# Altium schematic sheet MiniMax 4bit.schdoc
size 497 x 353 mm
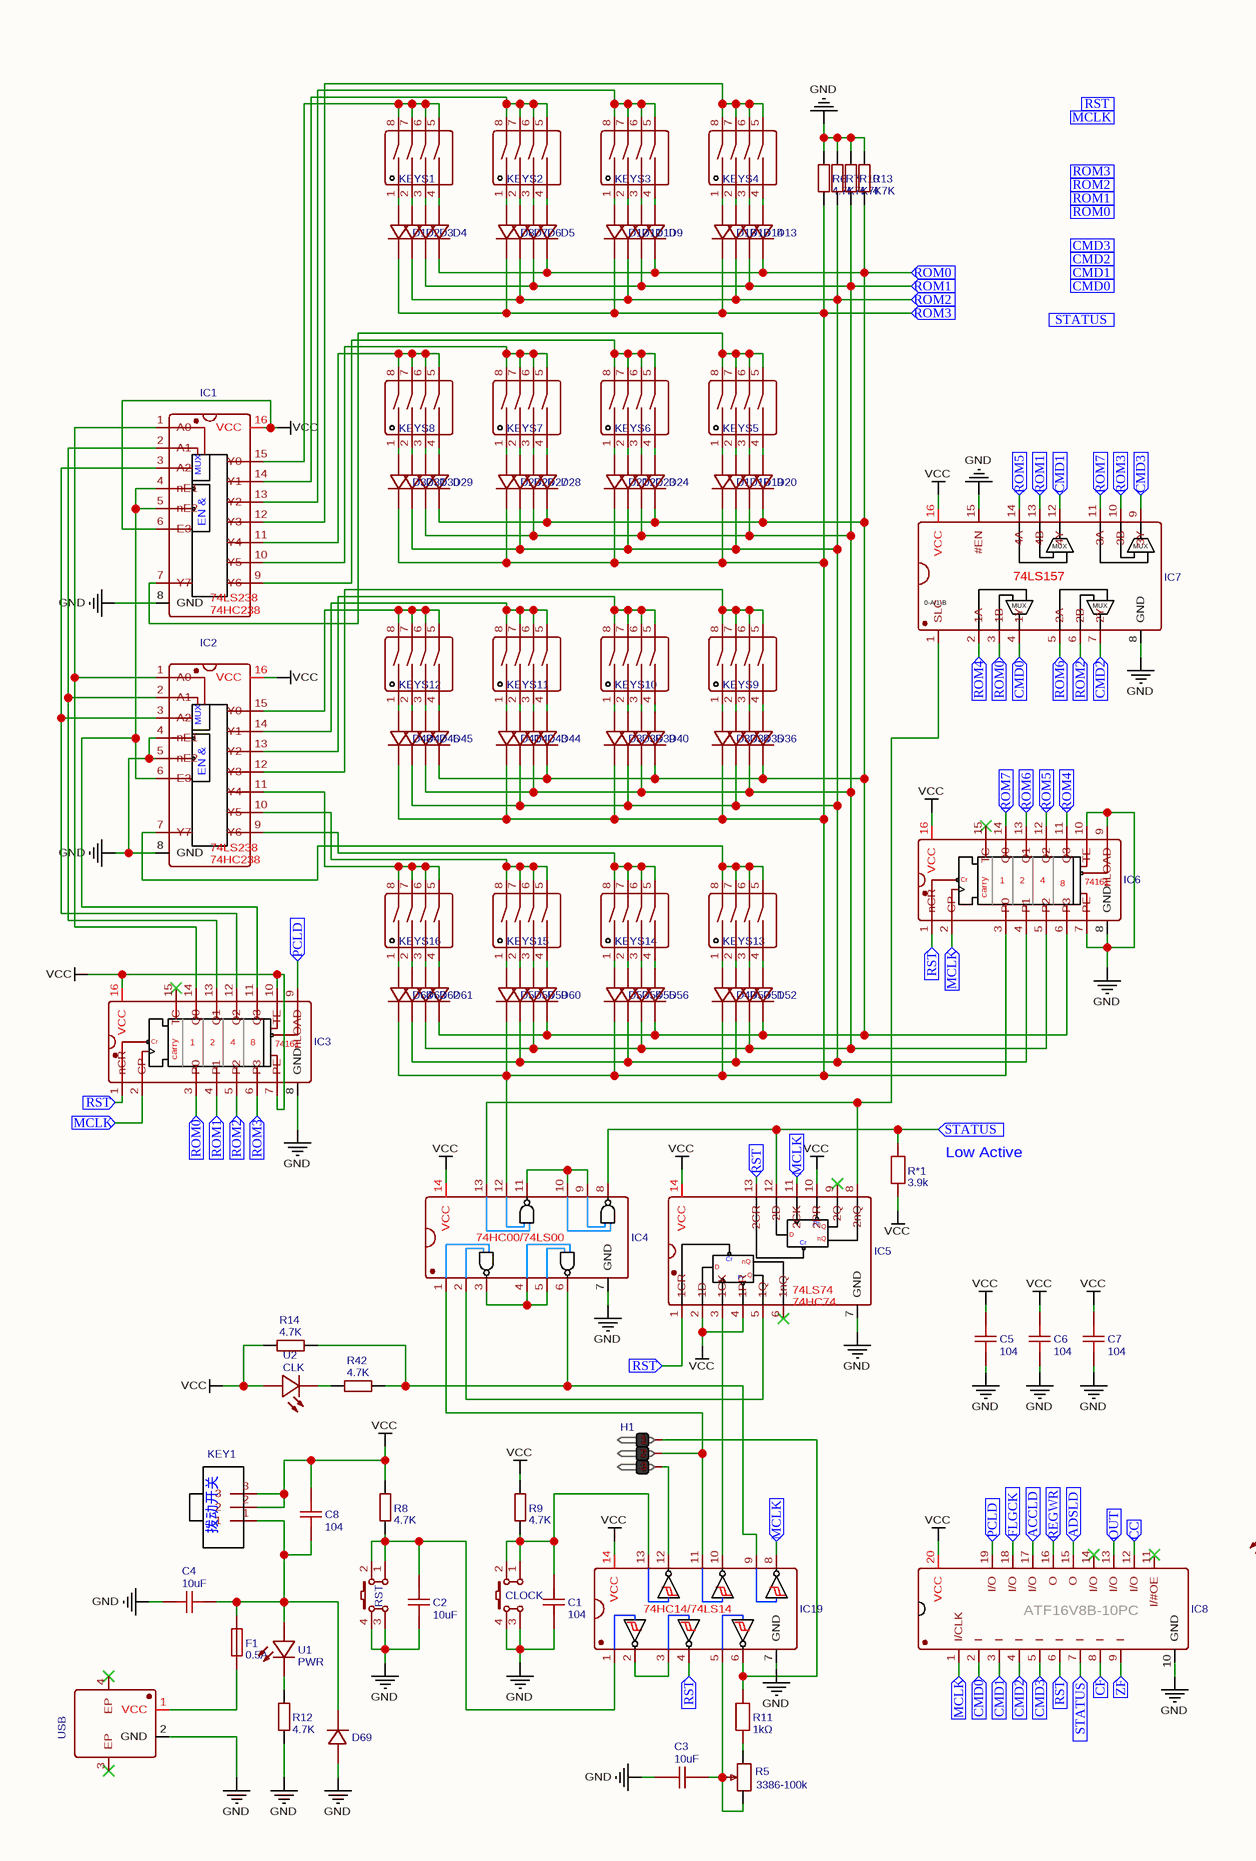
[diagram p0: MiniMax 4bit.schdoc, left]
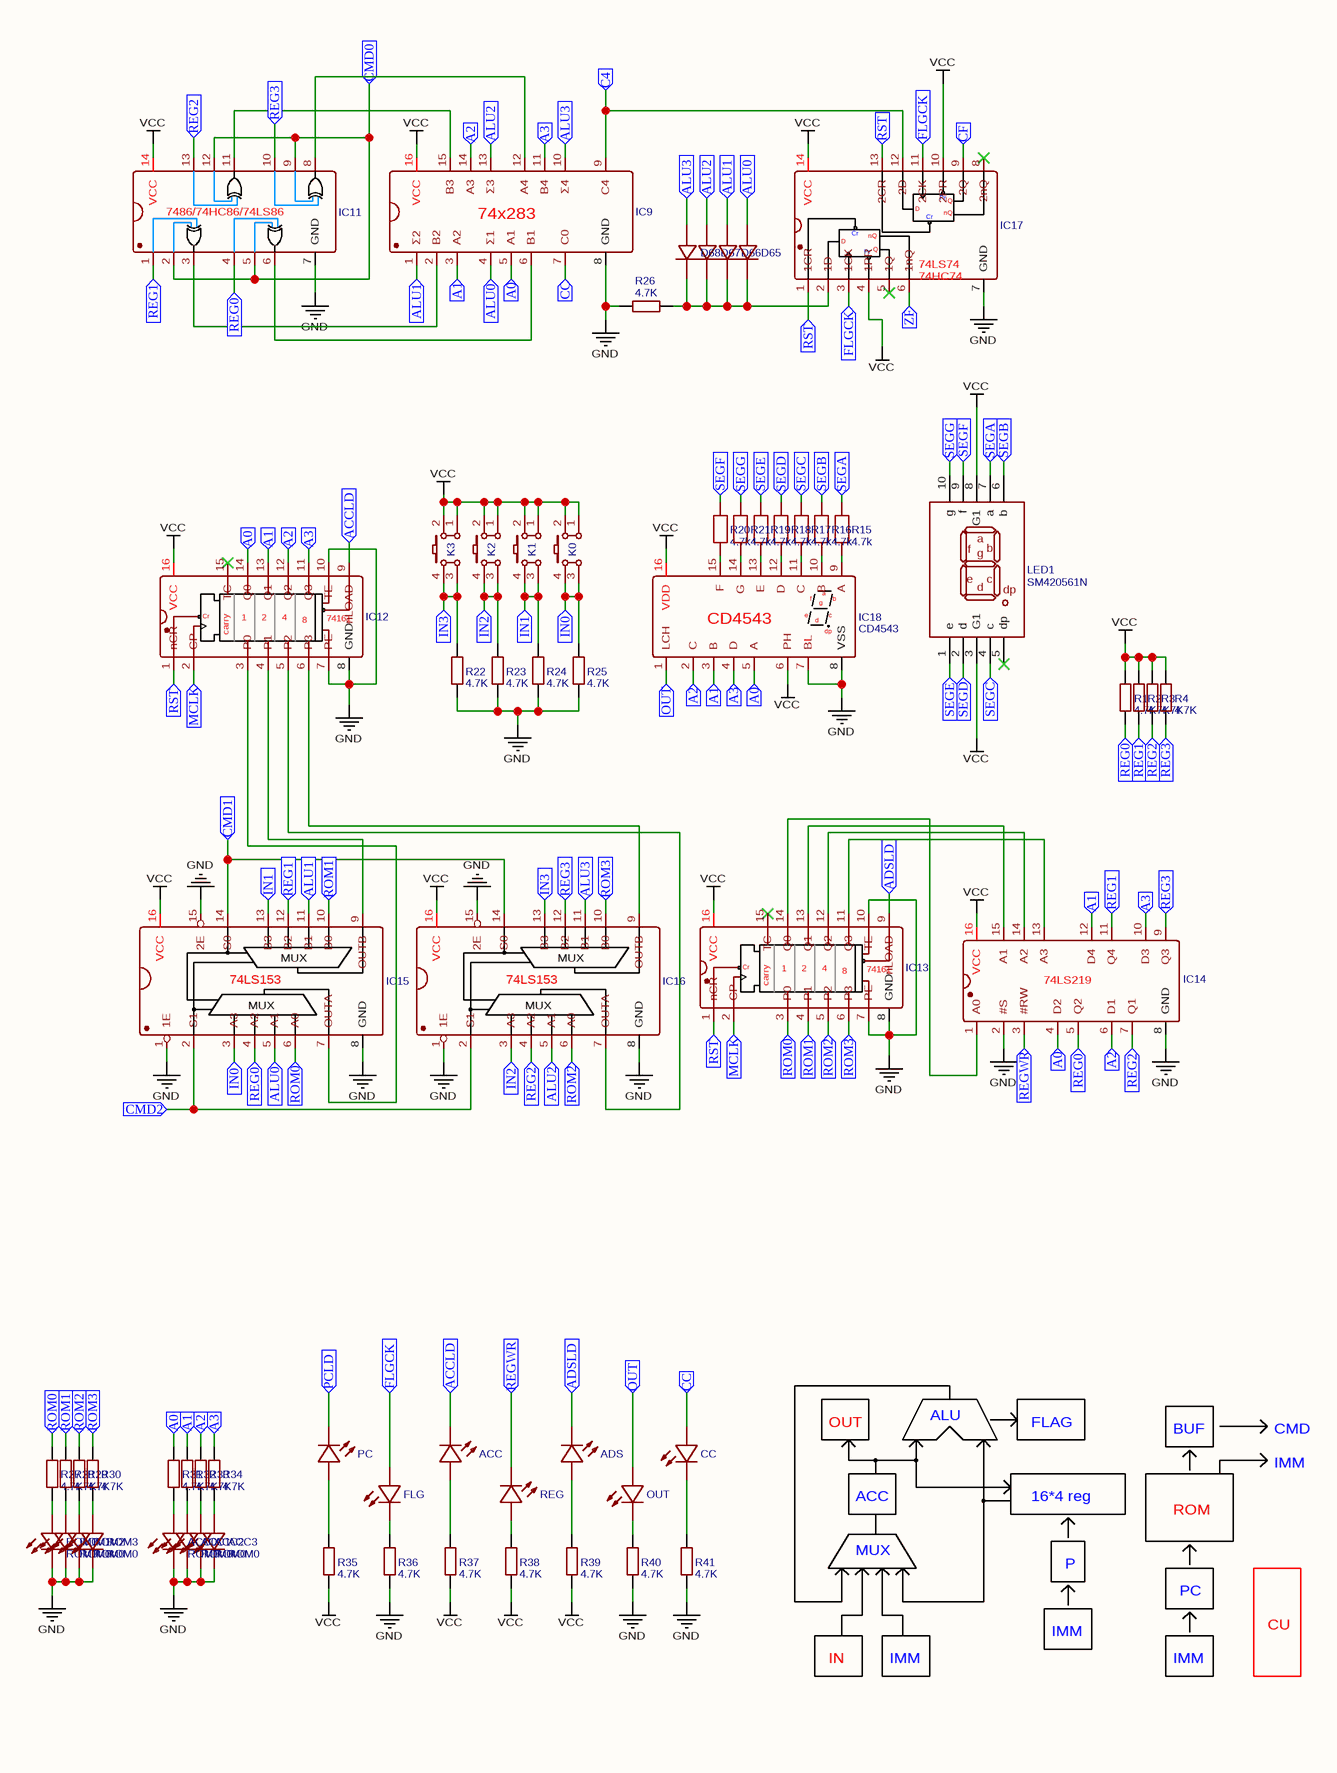
[diagram p1: MiniMax 4bit.schdoc, right]

## Parts
ACC  ROM0  [LED0805-RD]  (value not drawn)
ACC0  ROM0  [LED0805-RD]
ACC1  ROM0  [LED0805-RD]
ACC2  ROM0  [LED0805-RD]
ACC3  ROM0  [LED0805-RD]
ADS  ROM0  [LED0805-RD]  (value not drawn)
C1  104  [C0805]
C2  10uF  [C1206]
C3  10uF  [C1206]
C4  10uF  [C1206]
C5  104  [C0805]
C6  104  [C0805]
C7  104  [C0805]
C8  104  [C0805]
CC  ROM0  [LED0805-RD]  (value not drawn)
CLOCK  K4-6×6_TH  [KEY-TH_4P-L6.0-W6.0-P4.50-LS6.5]  (value not drawn)
D1  LL4148SG  [LL-34_L3.5-W1.5-LS3.5-FD]  (value not drawn)
D2  LL4148SG  [LL-34_L3.5-W1.5-LS3.5-FD]  (value not drawn)
D3  LL4148SG  [LL-34_L3.5-W1.5-LS3.5-FD]  (value not drawn)
D4  LL4148SG  [LL-34_L3.5-W1.5-LS3.5-FD]  (value not drawn)
D5  LL4148SG  [LL-34_L3.5-W1.5-LS3.5-FD]  (value not drawn)
D6  LL4148SG  [LL-34_L3.5-W1.5-LS3.5-FD]  (value not drawn)
D7  LL4148SG  [LL-34_L3.5-W1.5-LS3.5-FD]  (value not drawn)
D8  LL4148SG  [LL-34_L3.5-W1.5-LS3.5-FD]  (value not drawn)
D9  LL4148SG  [LL-34_L3.5-W1.5-LS3.5-FD]  (value not drawn)
D10  LL4148SG  [LL-34_L3.5-W1.5-LS3.5-FD]  (value not drawn)
D11  LL4148SG  [LL-34_L3.5-W1.5-LS3.5-FD]  (value not drawn)
D12  LL4148SG  [LL-34_L3.5-W1.5-LS3.5-FD]  (value not drawn)
D13  LL4148SG  [LL-34_L3.5-W1.5-LS3.5-FD]  (value not drawn)
D14  LL4148SG  [LL-34_L3.5-W1.5-LS3.5-FD]  (value not drawn)
D15  LL4148SG  [LL-34_L3.5-W1.5-LS3.5-FD]  (value not drawn)
D16  LL4148SG  [LL-34_L3.5-W1.5-LS3.5-FD]  (value not drawn)
D17  LL4148SG  [LL-34_L3.5-W1.5-LS3.5-FD]  (value not drawn)
D18  LL4148SG  [LL-34_L3.5-W1.5-LS3.5-FD]  (value not drawn)
D19  LL4148SG  [LL-34_L3.5-W1.5-LS3.5-FD]  (value not drawn)
D20  LL4148SG  [LL-34_L3.5-W1.5-LS3.5-FD]  (value not drawn)
D21  LL4148SG  [LL-34_L3.5-W1.5-LS3.5-FD]  (value not drawn)
D22  LL4148SG  [LL-34_L3.5-W1.5-LS3.5-FD]  (value not drawn)
D23  LL4148SG  [LL-34_L3.5-W1.5-LS3.5-FD]  (value not drawn)
D24  LL4148SG  [LL-34_L3.5-W1.5-LS3.5-FD]  (value not drawn)
D25  LL4148SG  [LL-34_L3.5-W1.5-LS3.5-FD]  (value not drawn)
D26  LL4148SG  [LL-34_L3.5-W1.5-LS3.5-FD]  (value not drawn)
D27  LL4148SG  [LL-34_L3.5-W1.5-LS3.5-FD]  (value not drawn)
D28  LL4148SG  [LL-34_L3.5-W1.5-LS3.5-FD]  (value not drawn)
D29  LL4148SG  [LL-34_L3.5-W1.5-LS3.5-FD]  (value not drawn)
D30  LL4148SG  [LL-34_L3.5-W1.5-LS3.5-FD]  (value not drawn)
D31  LL4148SG  [LL-34_L3.5-W1.5-LS3.5-FD]  (value not drawn)
D32  LL4148SG  [LL-34_L3.5-W1.5-LS3.5-FD]  (value not drawn)
D33  LL4148SG  [LL-34_L3.5-W1.5-LS3.5-FD]  (value not drawn)
D34  LL4148SG  [LL-34_L3.5-W1.5-LS3.5-FD]  (value not drawn)
D35  LL4148SG  [LL-34_L3.5-W1.5-LS3.5-FD]  (value not drawn)
D36  LL4148SG  [LL-34_L3.5-W1.5-LS3.5-FD]  (value not drawn)
D37  LL4148SG  [LL-34_L3.5-W1.5-LS3.5-FD]  (value not drawn)
D38  LL4148SG  [LL-34_L3.5-W1.5-LS3.5-FD]  (value not drawn)
D39  LL4148SG  [LL-34_L3.5-W1.5-LS3.5-FD]  (value not drawn)
D40  LL4148SG  [LL-34_L3.5-W1.5-LS3.5-FD]  (value not drawn)
D41  LL4148SG  [LL-34_L3.5-W1.5-LS3.5-FD]  (value not drawn)
D42  LL4148SG  [LL-34_L3.5-W1.5-LS3.5-FD]  (value not drawn)
D43  LL4148SG  [LL-34_L3.5-W1.5-LS3.5-FD]  (value not drawn)
D44  LL4148SG  [LL-34_L3.5-W1.5-LS3.5-FD]  (value not drawn)
D45  LL4148SG  [LL-34_L3.5-W1.5-LS3.5-FD]  (value not drawn)
D46  LL4148SG  [LL-34_L3.5-W1.5-LS3.5-FD]  (value not drawn)
D47  LL4148SG  [LL-34_L3.5-W1.5-LS3.5-FD]  (value not drawn)
D48  LL4148SG  [LL-34_L3.5-W1.5-LS3.5-FD]  (value not drawn)
D49  LL4148SG  [LL-34_L3.5-W1.5-LS3.5-FD]  (value not drawn)
D50  LL4148SG  [LL-34_L3.5-W1.5-LS3.5-FD]  (value not drawn)
D51  LL4148SG  [LL-34_L3.5-W1.5-LS3.5-FD]  (value not drawn)
D52  LL4148SG  [LL-34_L3.5-W1.5-LS3.5-FD]  (value not drawn)
D53  LL4148SG  [LL-34_L3.5-W1.5-LS3.5-FD]  (value not drawn)
D54  LL4148SG  [LL-34_L3.5-W1.5-LS3.5-FD]  (value not drawn)
D55  LL4148SG  [LL-34_L3.5-W1.5-LS3.5-FD]  (value not drawn)
D56  LL4148SG  [LL-34_L3.5-W1.5-LS3.5-FD]  (value not drawn)
D57  LL4148SG  [LL-34_L3.5-W1.5-LS3.5-FD]  (value not drawn)
D58  LL4148SG  [LL-34_L3.5-W1.5-LS3.5-FD]  (value not drawn)
D59  LL4148SG  [LL-34_L3.5-W1.5-LS3.5-FD]  (value not drawn)
D60  LL4148SG  [LL-34_L3.5-W1.5-LS3.5-FD]  (value not drawn)
D61  LL4148SG  [LL-34_L3.5-W1.5-LS3.5-FD]  (value not drawn)
D62  LL4148SG  [LL-34_L3.5-W1.5-LS3.5-FD]  (value not drawn)
D63  LL4148SG  [LL-34_L3.5-W1.5-LS3.5-FD]  (value not drawn)
D64  LL4148SG  [LL-34_L3.5-W1.5-LS3.5-FD]  (value not drawn)
D65  LL4148SG  [LL-34_L3.5-W1.5-LS3.5-FD]  (value not drawn)
D66  LL4148SG  [LL-34_L3.5-W1.5-LS3.5-FD]  (value not drawn)
D67  LL4148SG  [LL-34_L3.5-W1.5-LS3.5-FD]  (value not drawn)
D68  LL4148SG  [LL-34_L3.5-W1.5-LS3.5-FD]  (value not drawn)
D69  LL4148SG  [LL-34_L3.5-W1.5-LS3.5-FD]  (value not drawn)
F1  0.5A  [F1206]
FLG  ROM0  [LED0805-RD]  (value not drawn)
H1  排针V2_2.54_1X3  [HDR-TH_3P-P2.54-V-M-1]  (value not drawn)
IC1  74238/74LS238/74HC238  [PDIP-16]  (value not drawn)
IC2  74238/74LS238/74HC238  [PDIP-16]  (value not drawn)
IC3  74161/74LS161/74HC161  [PDIP-16]  (value not drawn)
IC4  7400/74LS00/74HC00  [DIP-14N]  (value not drawn)
IC5  7474/74LS74/74HC74  [DIP-14N]  (value not drawn)
IC6  74161/74LS161/74HC161  [PDIP-16]  (value not drawn)
IC7  74157/74LS157/74HC157  [PDIP-16]  (value not drawn)
IC8  ATF16V8B  [PDIP-20]  (value not drawn)
IC9  74283/74LS283/74HC283  [PDIP-16]  (value not drawn)
IC11  7486/74LS86/74HC86  [DIP-14N]  (value not drawn)
IC12  74161/74LS161/74HC161  [PDIP-16]  (value not drawn)
IC13  74161/74LS161/74HC161  [PDIP-16]  (value not drawn)
IC14  74LS219  [PDIP-16]  (value not drawn)
IC15  74153/74LS153/74HC153  [PDIP-16]  (value not drawn)
IC16  74153/74LS153/74HC153  [PDIP-16]  (value not drawn)
IC17  7474/74LS74/74HC74  [DIP-14N]  (value not drawn)
IC18  CD4543  [PDIP-16]
IC19  7414/74LS14/74HC14  [DIP-14N]  (value not drawn)
K0  K4-6×6_TH  [KEY-TH_4P-L6.0-W6.0-P4.50-LS6.5]  (value not drawn)
K1  K4-6×6_TH  [KEY-TH_4P-L6.0-W6.0-P4.50-LS6.5]  (value not drawn)
K2  K4-6×6_TH  [KEY-TH_4P-L6.0-W6.0-P4.50-LS6.5]  (value not drawn)
K3  K4-6×6_TH  [KEY-TH_4P-L6.0-W6.0-P4.50-LS6.5]  (value not drawn)
KEY1  拨动开关2.54*3直插  [拨动开关-2.54*3]  (value not drawn)
KEYS1  2.54 插件4位拨码开关  [2.54 插件4位拨码开关]  (value not drawn)
KEYS2  2.54 插件4位拨码开关  [2.54 插件4位拨码开关]  (value not drawn)
KEYS3  2.54 插件4位拨码开关  [2.54 插件4位拨码开关]  (value not drawn)
KEYS4  2.54 插件4位拨码开关  [2.54 插件4位拨码开关]  (value not drawn)
KEYS5  2.54 插件4位拨码开关  [2.54 插件4位拨码开关]  (value not drawn)
KEYS6  2.54 插件4位拨码开关  [2.54 插件4位拨码开关]  (value not drawn)
KEYS7  2.54 插件4位拨码开关  [2.54 插件4位拨码开关]  (value not drawn)
KEYS8  2.54 插件4位拨码开关  [2.54 插件4位拨码开关]  (value not drawn)
KEYS9  2.54 插件4位拨码开关  [2.54 插件4位拨码开关]  (value not drawn)
KEYS10  2.54 插件4位拨码开关  [2.54 插件4位拨码开关]  (value not drawn)
KEYS11  2.54 插件4位拨码开关  [2.54 插件4位拨码开关]  (value not drawn)
KEYS12  2.54 插件4位拨码开关  [2.54 插件4位拨码开关]  (value not drawn)
KEYS13  2.54 插件4位拨码开关  [2.54 插件4位拨码开关]  (value not drawn)
KEYS14  2.54 插件4位拨码开关  [2.54 插件4位拨码开关]  (value not drawn)
KEYS15  2.54 插件4位拨码开关  [2.54 插件4位拨码开关]  (value not drawn)
KEYS16  2.54 插件4位拨码开关  [2.54 插件4位拨码开关]  (value not drawn)
LED1  SM420561N  [LED-SEG-TH_10P-L12.7-W19.0-P2.54-S15.24-BL]
OUT  ROM0  [LED0805-RD]  (value not drawn)
PC  ROM0  [LED0805-RD]  (value not drawn)
R1  4.7K  [R0805]
R2  4.7K  [R0805]
R3  4.7K  [R0805]
R4  4.7K  [R0805]
R5  3386-100k  [RES-ADJ-TH_3386P]
R6  4.7K  [R0805]
R7  4.7K  [R0805]
R8  4.7K  [R0805]
R9  4.7K  [R0805]
R10  4.7K  [R0805]
R11  1kΩ  [R0805]
R12  4.7K  [R0805]
R13  4.7K  [R0805]
R14  4.7K  [R0805]
R15  4.7k  [R0805]
R16  4.7k  [R0805]
R17  4.7k  [R0805]
R18  4.7k  [R0805]
R19  4.7k  [R0805]
R20  4.7k  [R0805]
R21  4.7k  [R0805]
R22  4.7K  [R0805]
R23  4.7K  [R0805]
R24  4.7K  [R0805]
R25  4.7K  [R0805]
R26  4.7K  [R0805]
R27  4.7K  [R0805]
R28  4.7K  [R0805]
R29  4.7K  [R0805]
R30  4.7K  [R0805]
R31  4.7K  [R0805]
R32  4.7K  [R0805]
R33  4.7K  [R0805]
R34  4.7K  [R0805]
R35  4.7K  [R0805]
R36  4.7K  [R0805]
R37  4.7K  [R0805]
R38  4.7K  [R0805]
R39  4.7K  [R0805]
R40  4.7K  [R0805]
R41  4.7K  [R0805]
R42  4.7K  [R0805]
R*1  3.9k  [R0805]
REG  ROM0  [LED0805-RD]  (value not drawn)
ROM0  ROM0  [LED0805-RD]
ROM1  ROM0  [LED0805-RD]
ROM2  ROM0  [LED0805-RD]
ROM3  ROM0  [LED0805-RD]
RST  K4-6×6_TH  [KEY-TH_4P-L6.0-W6.0-P4.50-LS6.5]  (value not drawn)
U1  PWR  [LED0805-RD]
U2  CLK  [LED0805-RD]
USB  KH-TYPE-C-2P  [USB-SMD_KH-TYPE-C-2P]  (value not drawn)

## Ports
A0 (in), A1 (in), A2 (in), A3 (in), ACCLD (in), ADSLD (in), ALU0 (in), ALU1 (in), ALU2 (in), ALU3 (in), C4 (in), CC (in), CF (in), CMD0 (in), CMD1 (in), CMD2 (in), CMD3 (in), FLGCK (in), IN0 (in), IN1 (in), IN2 (in), IN3 (in), MCLK (in), OUT (in), PCLD (in), REG0 (in), REG1 (in), REG2 (in), REG3 (in), REGWR (in), ROM0 (in), ROM1 (in), ROM2 (in), ROM3 (in), ROM4 (in), ROM5 (in), ROM6 (in), ROM7 (in), RST (in), SEGA (in), SEGB (in), SEGC (in), SEGD (in), SEGE (in), SEGF (in), SEGG (in), STATUS (in), ZF (in)

## Nets
GND: ACC0.1(-) ACC1.1(-) ACC2.1(-) ACC3.1(-) C1.2 C2.1 C3.1 C4.2 C5.2 C6.2 C7.2 CLOCK.3 CLOCK.4 D69.1(A) IC1.8(GND) IC2.4(nE1) IC2.5(nE2) IC2.8(GND) IC3.8(GND) IC4.7(GND) IC5.7(GND) IC6.7(PE) IC6.8(GND) IC6.9(nLOAD) IC6.10(TE) IC7.8(GND) IC7.15(#EN) IC8.10(GND) IC9.8(GND) IC11.7(GND) IC12.7(PE) IC12.8(GND) IC12.10(TE) IC13.7(PE) IC13.8(GND) IC13.10(TE) IC14.2(#S) IC14.8(GND) IC15.1(1E) IC15.8(GND) IC15.15(2E) IC16.1(1E) IC16.8(GND) IC16.15(2E) IC17.7(GND) IC18.7(BL) IC18.8(VSS) IC19.7(GND) R6.2 R7.2 R10.2 R12.1 R13.2 R22.1 R23.1 R24.1 R25.1 R26.2 R36.1 R40.1 R41.1 ROM0.1(-) ROM1.1(-) ROM2.1(-) ROM3.1(-) RST.3 RST.4 USB.2(GND)
VCC: C5.1 C6.1 C7.1 C8.1 IC1.6(E3) IC1.16(VCC) IC2.16(VCC) IC3.7(PE) IC3.10(TE) IC3.16(VCC) IC4.14(VCC) IC5.2(1D) IC5.4(1PR) IC5.10(2PR) IC5.14(VCC) IC6.16(VCC) IC7.16(VCC) IC8.20(VCC) IC9.16(VCC) IC11.14(VCC) IC12.16(VCC) IC13.16(VCC) IC14.16(VCC) IC15.16(VCC) IC16.16(VCC) IC17.4(1PR) IC17.10(2PR) IC17.14(VCC) IC18.6(PH) IC18.16(VDD) IC19.14(VCC) K0.1 K0.2 K1.1 K1.2 K2.1 K2.2 K3.1 K3.2 KEY1.2 KEY1.3 LED1.3(G1) LED1.8(G1) R1.2 R2.2 R3.2 R4.2 R8.2 R9.2 R14.2 R35.1 R37.1 R38.1 R39.1 R*1.2 U2.2(+)
A0: IC9.5(A1) IC12.14(Q0) IC14.4(D2) IC18.5(A) R31.2 ; port A0
A1: IC9.3(A2) IC12.13(Q1) IC14.12(D4) IC18.3(B) R32.2 ; port A1
A2: IC9.14(A3) IC12.12(Q2) IC14.6(D1) IC18.2(C) R33.2 ; port A2
A3: IC9.11(B4) IC12.11(Q3) IC14.10(D3) IC18.4(D) R34.2 ; port A3
ACCLD: ACC.1(-) IC8.17(I/O) IC12.9(nLOAD) ; port ACCLD
ADSLD: ADS.1(-) IC8.15(O) IC13.9(nLOAD) IC13.11(Q3) IC14.13(A3) ; port ADSLD
ALU0: D65.1(A) IC9.4(Σ1) IC15.5(A1) ; port ALU0
ALU1: D66.1(A) IC9.1(Σ2) IC15.11(B1) ; port ALU1
ALU2: D67.1(A) IC9.13(Σ3) IC16.5(A1) ; port ALU2
ALU3: D68.1(A) IC9.10(Σ4) IC16.11(B1) ; port ALU3
C4: IC9.9(C4) IC17.12(2D) ; port C4
CC: CC.2(+) IC8.12(I/O) IC9.7(C0) ; port CC
CF: IC8.8(I) IC17.9(2Q) ; port CF
CMD0: IC7.4(1Y) IC8.2(I) IC11.2(1B) IC11.5(2B) IC11.9(3A) IC11.12(4A) ; port CMD0
CMD1: IC7.12(4Y) IC8.3(I) IC15.14(S0) IC16.14(S0) ; port CMD1
CMD2: IC7.7(2Y) IC8.4(I) IC15.2(S1) IC16.2(S1) ; port CMD2
CMD3: IC7.9(3Y) IC8.5(I) ; port CMD3
FLGCK: FLG.2(+) IC8.18(I/O) IC17.3(1CK) IC17.11(2CK) ; port FLGCK
IN0: IC15.3(A3) K0.3 K0.4 R25.2 ; port IN0
IN1: IC15.13(B3) K1.3 K1.4 R24.2 ; port IN1
IN2: IC16.3(A3) K2.3 K2.4 R23.2 ; port IN2
IN3: IC16.13(B3) K3.3 K3.4 R22.2 ; port IN3
MCLK: IC3.2(CP) IC5.11(2CK) IC6.2(CP) IC8.1(I/CLK) IC12.2(CP) IC13.2(CP) IC19.8(6Y) ; port MCLK
OUT: IC8.13(I/O) IC18.1(LCH) OUT.2(+) ; port OUT
PCLD: IC3.9(nLOAD) IC8.19(I/O) PC.1(-) ; port PCLD
REG0: IC11.4(2A) IC14.5(Q2) IC15.4(A2) R1.1 ; port REG0
REG1: IC11.1(1A) IC14.11(Q4) IC15.12(B2) R2.1 ; port REG1
REG2: IC11.13(4B) IC14.7(Q1) IC16.4(A2) R3.1 ; port REG2
REG3: IC11.10(3B) IC14.9(Q3) IC16.12(B2) R4.1 ; port REG3
REGWR: IC8.16(O) IC14.3(#RW) REG.1(-) ; port REGWR
ROM0: D4.2(C) D5.2(C) D9.2(C) D13.2(C) D20.2(C) D24.2(C) D28.2(C) D29.2(C) D36.2(C) D40.2(C) D44.2(C) D45.2(C) D52.2(C) D56.2(C) D60.2(C) D61.2(C) IC3.3(P0) IC6.6(P3) IC7.3(1B) IC13.3(P0) IC15.6(A0) R13.1 R27.2 ; port ROM0
ROM1: D3.2(C) D6.2(C) D10.2(C) D14.2(C) D19.2(C) D23.2(C) D27.2(C) D30.2(C) D35.2(C) D39.2(C) D43.2(C) D46.2(C) D51.2(C) D55.2(C) D59.2(C) D62.2(C) IC3.4(P1) IC6.5(P2) IC7.13(4B) IC13.4(P1) IC15.10(B0) R10.1 R28.2 ; port ROM1
ROM2: D2.2(C) D7.2(C) D11.2(C) D15.2(C) D18.2(C) D22.2(C) D26.2(C) D31.2(C) D34.2(C) D38.2(C) D42.2(C) D47.2(C) D50.2(C) D54.2(C) D58.2(C) D63.2(C) IC3.5(P2) IC6.4(P1) IC7.6(2B) IC13.5(P2) IC16.6(A0) R7.1 R29.2 ; port ROM2
ROM3: D1.2(C) D8.2(C) D12.2(C) D16.2(C) D17.2(C) D21.2(C) D25.2(C) D32.2(C) D33.2(C) D37.2(C) D41.2(C) D48.2(C) D49.2(C) D53.2(C) D57.2(C) D64.2(C) IC3.6(P3) IC4.12(4A) IC6.3(P0) IC7.10(3B) IC13.6(P3) IC16.10(B0) R6.1 R30.2 ; port ROM3
ROM4: IC6.11(Q3) IC7.2(1A) ; port ROM4
ROM5: IC6.12(Q2) IC7.14(4A) ; port ROM5
ROM6: IC6.13(Q1) IC7.5(2A) ; port ROM6
ROM7: IC6.14(Q0) IC7.11(3A) ; port ROM7
RST: IC3.1(nCR) IC5.1(1CR) IC5.13(2CR) IC6.1(nCR) IC8.6(I) IC12.1(nCR) IC13.1(nCR) IC17.1(1CR) IC17.13(2CR) IC19.4(2Y) ; port RST
SEGA: LED1.7(a) R15.2 ; port SEGA
SEGB: LED1.6(b) R16.2 ; port SEGB
SEGC: LED1.4(c) R17.2 ; port SEGC
SEGD: LED1.2(d) R18.2 ; port SEGD
SEGE: LED1.1(e) R19.2 ; port SEGE
SEGF: LED1.9(f) R20.2 ; port SEGF
SEGG: LED1.10(g) R21.2 ; port SEGG
STATUS: IC4.8(3Y) IC5.12(2D) IC8.7(I) R*1.1 ; port STATUS
ZF: IC8.9(I) IC17.6(1nQ) ; port ZF
NetACC0_2: ACC0.2(+) R31.1
NetACC1_2: ACC1.2(+) R32.1
NetACC2_2: ACC2.2(+) R33.1
NetACC3_2: ACC3.2(+) R34.1
NetACC_2: ACC.2(+) R37.2
NetADS_2: ADS.2(+) R39.2
NetC1_1: C1.1 CLOCK.1 CLOCK.2 IC19.13(4A) R9.1
NetC2_2: C2.2 IC19.1(1A) R8.1 RST.1 RST.2
NetC3_2: C3.2 IC19.5(3A) R5.2 R5.3
NetC4_1: C4.1 C8.2 D69.2(C) F1.2 KEY1.1 U1.2(+)
NetCC_1: CC.1(-) R41.2
NetD1_1: D1.1(A) KEYS1.1
NetD2_1: D2.1(A) KEYS1.2
NetD3_1: D3.1(A) KEYS1.3
NetD4_1: D4.1(A) KEYS1.4
NetD5_1: D5.1(A) KEYS2.4
NetD6_1: D6.1(A) KEYS2.3
NetD7_1: D7.1(A) KEYS2.2
NetD8_1: D8.1(A) KEYS2.1
NetD9_1: D9.1(A) KEYS3.4
NetD10_1: D10.1(A) KEYS3.3
NetD11_1: D11.1(A) KEYS3.2
NetD12_1: D12.1(A) KEYS3.1
NetD13_1: D13.1(A) KEYS4.4
NetD14_1: D14.1(A) KEYS4.3
NetD15_1: D15.1(A) KEYS4.2
NetD16_1: D16.1(A) KEYS4.1
NetD17_1: D17.1(A) KEYS5.1
NetD18_1: D18.1(A) KEYS5.2
NetD19_1: D19.1(A) KEYS5.3
NetD20_1: D20.1(A) KEYS5.4
NetD21_1: D21.1(A) KEYS6.1
NetD22_1: D22.1(A) KEYS6.2
NetD23_1: D23.1(A) KEYS6.3
NetD24_1: D24.1(A) KEYS6.4
NetD25_1: D25.1(A) KEYS7.1
NetD26_1: D26.1(A) KEYS7.2
NetD27_1: D27.1(A) KEYS7.3
NetD28_1: D28.1(A) KEYS7.4
NetD29_1: D29.1(A) KEYS8.4
NetD30_1: D30.1(A) KEYS8.3
NetD31_1: D31.1(A) KEYS8.2
NetD32_1: D32.1(A) KEYS8.1
NetD33_1: D33.1(A) KEYS9.1
NetD34_1: D34.1(A) KEYS9.2
NetD35_1: D35.1(A) KEYS9.3
NetD36_1: D36.1(A) KEYS9.4
NetD37_1: D37.1(A) KEYS10.1
NetD38_1: D38.1(A) KEYS10.2
NetD39_1: D39.1(A) KEYS10.3
NetD40_1: D40.1(A) KEYS10.4
NetD41_1: D41.1(A) KEYS11.1
NetD42_1: D42.1(A) KEYS11.2
NetD43_1: D43.1(A) KEYS11.3
NetD44_1: D44.1(A) KEYS11.4
NetD45_1: D45.1(A) KEYS12.4
NetD46_1: D46.1(A) KEYS12.3
NetD47_1: D47.1(A) KEYS12.2
NetD48_1: D48.1(A) KEYS12.1
NetD49_1: D49.1(A) KEYS13.1
NetD50_1: D50.1(A) KEYS13.2
NetD51_1: D51.1(A) KEYS13.3
NetD52_1: D52.1(A) KEYS13.4
NetD53_1: D53.1(A) KEYS14.1
NetD54_1: D54.1(A) KEYS14.2
NetD55_1: D55.1(A) KEYS14.3
NetD56_1: D56.1(A) KEYS14.4
NetD57_1: D57.1(A) KEYS15.1
NetD58_1: D58.1(A) KEYS15.2
NetD59_1: D59.1(A) KEYS15.3
NetD60_1: D60.1(A) KEYS15.4
NetD61_1: D61.1(A) KEYS16.4
NetD62_1: D62.1(A) KEYS16.3
NetD63_1: D63.1(A) KEYS16.2
NetD64_1: D64.1(A) KEYS16.1
NetD65_2: D65.2(C) D66.2(C) D67.2(C) D68.2(C) IC17.2(1D) R26.1
NetF1_1: F1.1 USB.1(VCC)
NetFLG_1: FLG.1(-) R36.2
NetH1_1: H1.1 IC19.6(3Y) R11.2
NetH1_2: H1.2 IC4.1(1A) IC19.11(5A)
NetH1_3: H1.3 IC19.12(4Y)
NetIC1_1: IC1.1(A0) IC2.1(A0) IC3.14(Q0)
NetIC1_2: IC1.2(A1) IC2.2(A1) IC3.13(Q1)
NetIC1_3: IC1.3(A2) IC2.3(A2) IC3.12(Q2)
NetIC1_4: IC1.4(nE1) IC1.5(nE2) IC2.6(E3) IC3.11(Q3)
NetIC1_7: IC1.7(Y7) KEYS5.5 KEYS5.6 KEYS5.7 KEYS5.8
NetIC1_9: IC1.9(Y6) KEYS6.5 KEYS6.6 KEYS6.7 KEYS6.8
NetIC1_10: IC1.10(Y5) KEYS7.5 KEYS7.6 KEYS7.7 KEYS7.8
NetIC1_11: IC1.11(Y4) KEYS8.5 KEYS8.6 KEYS8.7 KEYS8.8
NetIC1_12: IC1.12(Y3) KEYS4.5 KEYS4.6 KEYS4.7 KEYS4.8
NetIC1_13: IC1.13(Y2) KEYS3.5 KEYS3.6 KEYS3.7 KEYS3.8
NetIC1_14: IC1.14(Y1) KEYS2.5 KEYS2.6 KEYS2.7 KEYS2.8
NetIC1_15: IC1.15(Y0) KEYS1.5 KEYS1.6 KEYS1.7 KEYS1.8
NetIC2_7: IC2.7(Y7) KEYS13.5 KEYS13.6 KEYS13.7 KEYS13.8
NetIC2_9: IC2.9(Y6) KEYS14.5 KEYS14.6 KEYS14.7 KEYS14.8
NetIC2_10: IC2.10(Y5) KEYS15.5 KEYS15.6 KEYS15.7 KEYS15.8
NetIC2_11: IC2.11(Y4) KEYS16.5 KEYS16.6 KEYS16.7 KEYS16.8
NetIC2_12: IC2.12(Y3) KEYS9.5 KEYS9.6 KEYS9.7 KEYS9.8
NetIC2_13: IC2.13(Y2) KEYS10.5 KEYS10.6 KEYS10.7 KEYS10.8
NetIC2_14: IC2.14(Y1) KEYS11.5 KEYS11.6 KEYS11.7 KEYS11.8
NetIC2_15: IC2.15(Y0) KEYS12.5 KEYS12.6 KEYS12.7 KEYS12.8
NetIC4_2: IC4.2(1B) IC5.5(1Q)
NetIC4_3: IC4.3(1Y) IC4.4(2A) IC4.5(2B)
NetIC4_6: IC4.6(2Y) IC19.9(6A) R14.1 R42.1
NetIC4_9: IC4.9(3A) IC4.10(3B) IC4.11(4Y)
NetIC4_13: IC4.13(4B) IC5.8(2nQ) IC7.1(SLC)
NetIC5_3: IC5.3(1CK) IC19.10(5Y)
NetIC9_2: IC9.2(B2) IC11.3(1Y)
NetIC9_6: IC9.6(B1) IC11.6(2Y)
NetIC9_12: IC9.12(A4) IC11.8(3Y)
NetIC9_15: IC9.15(B3) IC11.11(4Y)
NetIC12_3: IC12.3(P0) IC15.7(OUTA)
NetIC12_4: IC12.4(P1) IC15.9(OUTB)
NetIC12_5: IC12.5(P2) IC16.7(OUTA)
NetIC12_6: IC12.6(P3) IC16.9(OUTB)
NetIC13_12: IC13.12(Q2) IC14.14(A2)
NetIC13_13: IC13.13(Q1) IC14.15(A1)
NetIC13_14: IC13.14(Q0) IC14.1(A0)
NetIC18_9: IC18.9(A) R15.1
NetIC18_10: IC18.10(B) R16.1
NetIC18_11: IC18.11(C) R17.1
NetIC18_12: IC18.12(D) R18.1
NetIC18_13: IC18.13(E) R19.1
NetIC18_14: IC18.14(G) R21.1
NetIC18_15: IC18.15(F) R20.1
NetIC19_2: IC19.2(1Y) IC19.3(2A)
NetOUT_1: OUT.1(-) R40.2
NetPC_2: PC.2(+) R35.2
NetR5_1: R5.1 R11.1
NetR12_2: R12.2 U1.1(-)
NetR27_1: R27.1 ROM0.2(+)
NetR28_1: R28.1 ROM1.2(+)
NetR29_1: R29.1 ROM2.2(+)
NetR30_1: R30.1 ROM3.2(+)
NetR38_2: R38.2 REG.2(+)
NetR42_2: R42.2 U2.1(-)

Not connected (* = marked no-connect by the designer): IC3 15(TC)*; IC5 6(1nQ)* 9(2Q)*; IC6 15(TC)*; IC8 11(I/#OE)* 14(I/O)*; IC12 15(TC)*; IC13 15(TC)*; IC17 5(1Q)* 8(2nQ)*; LED1 5(dp)*; USB 3(EP)* 4(EP)*

## Notes on the sheet
- (near R*1) Low Active
- ALU
- OUT
- FLAG
- BUF
- CMD
- IMM
- ACC
- MUX
- 16*4 reg
- ROM
- P
- PC
- IN
- CU
- (in symbol 7400/74LS00/74HC00) 74HC00/74LS00
- (in symbol 7414/74LS14/74HC14) 74HC14/74LS14
- (in symbol 7474/74LS74/74HC74) Pr; Q; D; Cr; nQ; 74LS74 / 74HC74
- (in symbol 7486/74LS86/74HC86) 7486/74HC86/74LS86
- (in symbol 74153/74LS153/74HC153) MUX; 74LS153
- (in symbol 74157/74LS157/74HC157) MUX; 74LS157; 0-A/1-B
- (in symbol 74161/74LS161/74HC161) Cr; 74161; carry
- (in symbol 74238/74LS238/74HC238) MUX; EN &; 74LS238 / 74HC238
- (in symbol 74283/74LS283/74HC283) 74x283
- (in symbol ATF16V8B) ATF16V8B-10PC
- (in symbol CD4543) a; f; b; g; e; c; d; dp
- (in symbol 拨动开关2.54*3直插) 拨动开关

## Library data of the parts
ACC ACC0-ACC3 ADS CC FLG OUT PC REG ROM0-ROM3 = ROM0: Manufacturer: null; Manufacturer Part: LED0805-1; Contributor: LCSC; Supplier: LCSC; Supplier Part: C9900006888; JLCPCB Part Class: Extended Part; spicePre: U; spiceSymbolName: LED0805-1
C1 C5-C8 = 104: Manufacturer: YAGEO(国巨); Manufacturer Part: CC0805JRX7R7BB104; Capacitance: 100nF; Contributor: lcsc; Supplier: LCSC; Supplier Part: C520082; spicePre: C; spiceSymbolName: CC0805JRX7R7BB104
C2-C4 = 10uF: Manufacturer: KEMET(基美); Manufacturer Part: C1206C225J5RECAUTO; nameAlias: Capacitance; Contributor: lcsc; Supplier: LCSC; Supplier Part: C1513220; JLCPCB Part Class: Extended Part; spicePre: C; spiceSymbolName: C1206C225J5RECAUTO
CLOCK K0-K3 RST = K4-6×6_TH: Manufacturer: 韩国韩荣; Manufacturer Part: K2-1102DP-E4SW-04; Contributor: LCEDA_Lib; Supplier: LCSC; Supplier Part: C136684; spicePre: K; spiceSymbolName: K4-6×6_TH
D1-D69 = LL4148SG: Manufacturer: null; Contributor: lcsc; Supplier: LCSC; Supplier Part: C9900015421; Manufacturer Part: LL4148SG; JLCPCB Part Class: Extended Part; spicePre: U; spiceSymbolName: LL4148SG
F1 = 0.5A: Manufacturer: Littelfuse(美国力特); Manufacturer Part: 1206L016WR; Contributor: LCSC; Supplier: LCSC; Supplier Part: C151161; JLCPCB Part Class: Extended Part; spicePre: F; spiceSymbolName: 1206L016WR
H1 = 排针V2_2.54_1X3: Manufacturer: BOOMELE; Manufacturer Part: Header2.54mm 1*3P; Contributor: WOSHI6666444444; Supplier: LCSC; Supplier Part: C49257; JLCPCB Part Class: Extended Part; spicePre: H; spiceSymbolName: 排针V2_2.54_1X3
IC1 IC2 = 74238/74LS238/74HC238: Manufacturer: FM富满; Manufacturer Part: 74HC138T; Contributor: king13478509115; Supplier: LCSC; Supplier Part: C2906781; spicePre: I; spiceSymbolName: 74238/74LS238/74HC238
IC3 IC6 IC12 IC13 = 74161/74LS161/74HC161: Manufacturer: TI(德州仪器); Manufacturer Part: CD74HC161E; Contributor: king13478509115; Supplier: LCSC; Supplier Part: C1523311; spicePre: I; spiceSymbolName: 74161/74LS161/74HC161
IC4 = 7400/74LS00/74HC00: Manufacturer: TI; Manufacturer Part: SN74HC00N; Contributor: king13478509115; spicePre: X; Supplier: LCSC; Supplier Part: C2902; JLCPCB Part Class: Extended Part; spiceSymbolName: 7400/74LS00/74HC00
IC5 IC17 = 7474/74LS74/74HC74: Manufacturer: RENESAS(瑞萨)/IDT; Manufacturer Part: HD74HC74P; Contributor: king13478509115; Supplier: LCSC; Supplier Part: C5275; JLCPCB Part Class: Extended Part; spicePre: I; spiceSymbolName: 7474/74LS74/74HC74
IC7 = 74157/74LS157/74HC157: Manufacturer: Texas Instruments; Manufacturer Part: SN74LS148N; Contributor: king13478509115; Supplier: LCSC; Supplier Part: C81840; JLCPCB Part Class: Extended Part; spicePre: I; spiceSymbolName: 74157/74LS157/74HC157
IC8 = ATF16V8B: Manufacturer: ATMEL; Contributor: king13478509115; spicePre: X; spiceSymbolName: ATF16V8B
IC9 = 74283/74LS283/74HC283: Contributor: king13478509115; spicePre: I; spiceSymbolName: 74283/74LS283/74HC283
IC11 = 7486/74LS86/74HC86: Manufacturer: TI; Manufacturer Part: SN74HC00N; Contributor: king13478509115; spicePre: X; Supplier: LCSC; Supplier Part: C2902; JLCPCB Part Class: Extended Part; spiceSymbolName: 7486/74LS86/74HC86
IC14 = 74LS219: Manufacturer: TI(德州仪器); Contributor: king13478509115; Supplier: LCSC; spicePre: I; spiceSymbolName: 74LS219
IC15 IC16 = 74153/74LS153/74HC153: Manufacturer: Texas Instruments; Manufacturer Part: SN74LS148N; Contributor: king13478509115; Supplier: LCSC; Supplier Part: C81840; JLCPCB Part Class: Extended Part; spicePre: I; spiceSymbolName: 74153/74LS153/74HC153
IC18 = CD4543: Contributor: king13478509115; spicePre: U; spiceSymbolName: CD4543
IC19 = 7414/74LS14/74HC14: Contributor: king13478509115; spicePre: I; spiceSymbolName: 7414/74LS14/74HC14
KEY1 = 拨动开关2.54*3直插: Contributor: Guest; spicePre: K; spiceSymbolName: 拨动开关2.54*3直插
KEYS1-KEYS16 = 2.54 插件4位拨码开关: Contributor: king13478509115; spicePre: K; spiceSymbolName: 2.54 插件4位拨码开关
LED1 = SM420561N: Manufacturer: ARKLED(方舟); Contributor: LCSC; Supplier: LCSC; Manufacturer Part: SM420561N; Supplier Part: C141367; JLCPCB Part Class: Extended Part; spicePre: L; spiceSymbolName: SM420561N
R1-R4 R6-R10 R12-R14 R22-R42 = 4.7K: Manufacturer: YAGEO(国巨); Manufacturer Part: RC0805JR-074K7L; nameAlias: Resistance (Ohms); Resistance: 4.7kΩ; Supplier: LCSC; Supplier Part: C105427; JLCPCB Part Class: Extended Part; spicePre: R; spiceSymbolName: RC0805JR-074K7L
R5 = 3386-100k: Manufacturer: ReliaPro; Manufacturer Part: 3386P-1-105; nameAlias: Resistance(Ohms); Supplier: LCSC; Supplier Part: C5038; spicePre: R; spiceSymbolName: 3386P-1-105
R11 = 1kΩ: Manufacturer: VO(翔胜); Manufacturer Part: SCR0805F1K; Contributor: lcsc; nameAlias: Resistance; Supplier: LCSC; Supplier Part: C3016664; link: https://atta.szlcsc.com/upload/public/pdf/source/20220513/247AF9639BA21CF93567DC289CCC6A22.pdf; spicePre: U; spiceSymbolName: SCR0805F1K
R15-R21 = 4.7k: Manufacturer: VO(翔胜); Manufacturer Part: SCR0603J1K; Contributor: lcsc; nameAlias: Resistance; Supplier: LCSC; Supplier Part: C3017736; JLCPCB Part Class: Extended Part; spicePre: R; spiceSymbolName: SCR0603J1K
R*1 = 3.9k: Manufacturer: VO(翔胜); Manufacturer Part: SCR0805F1K; Contributor: lcsc; nameAlias: Resistance; Supplier: LCSC; Supplier Part: C3016664; link: https://atta.szlcsc.com/upload/public/pdf/source/20220513/247AF9639BA21CF93567DC289CCC6A22.pdf; spicePre: U; spiceSymbolName: SCR0805F1K
U1 = PWR: Manufacturer: null; Manufacturer Part: LED0805-1; Contributor: LCSC; Supplier: LCSC; Supplier Part: C9900006888; JLCPCB Part Class: Extended Part; spicePre: U; spiceSymbolName: LED0805-1
U2 = CLK: Manufacturer: null; Manufacturer Part: LED0805-1; Contributor: LCSC; Supplier: LCSC; Supplier Part: C9900006888; JLCPCB Part Class: Extended Part; spicePre: U; spiceSymbolName: LED0805-1
USB = KH-TYPE-C-2P: Manufacturer: kinghelm(金航标); Contributor: king13478509115; Supplier: LCSC; Supplier Part: C2919656; Manufacturer Part: KH-TYPE-C-2P; JLCPCB Part Class: Extended Part; spicePre: U; spiceSymbolName: KH-TYPE-C-2P